# Altium schematic sheet SG_Power_Supplies.SchDoc
size A
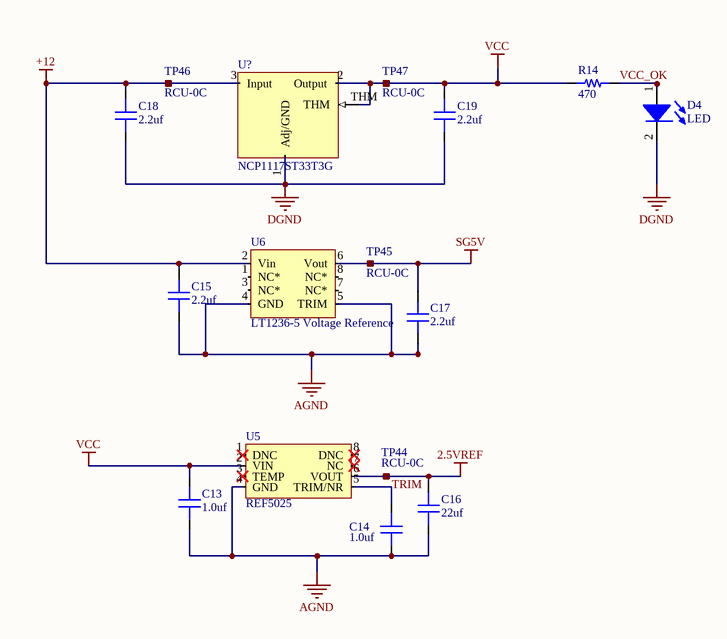
[diagram p0: SG_Power_Supplies.SchDoc]

## Parts
C13  value 1.0uf  [CAP 0603/1608]  (hidden comment: Capacitor MLCC 1.0uf 25V CAP 0603/1608)
C14  value 1.0uf  [CAP 0603/1608]  (hidden comment: Capacitor MLCC 1.0uf 25V CAP 0603/1608)
C15  value 2.2uf  [CAP 0603/1608]  (hidden comment: Capacitor MLCC 2.2uf 25V CAP 0603/1608)
C16  value 22uf  [CAP 0603/1608]  (hidden comment: Capacitor MLCC 22uf 16V CAP 0603/1608)
C17  value 2.2uf  [CAP 0603/1608]  (hidden comment: Capacitor MLCC 2.2uf 25V CAP 0603/1608)
C18  value 2.2uf  [CAP 0805/2012]  (hidden comment: Capacitor MLCC 2.2uf 25V CAP 0805/2012)
C19  value 2.2uf  [CAP 0805/2012]  (hidden comment: Capacitor MLCC 2.2uf 25V CAP 0805/2012)
D4  LED  [0805_LED]
R14  value 470  [RES 0805/2012]  (hidden comment: Resistor 470 0805 1/10W 1%)
TP44  RCU-0C  [RCU-0C]
TP45  RCU-0C  [RCU-0C]
TP46  RCU-0C  [RCU-0C]
TP47  RCU-0C  [RCU-0C]
U5  REF5025  [SOIC-8]
U6  LT1236-5 Voltage Reference  [SOIC-8]
U?  NCP1117ST33T3G  [SOT-223-3]

## Nets
2.5VREF: C16.2 TP44.1 U5.6(VOUT)
+12: C15.2 C18.2 TP46.1 U6.2(Vin) U?.3(Input)
AGND: C13.1 C14.1 C15.1 C16.1 C17.1 U5.4(GND) U6.4(GND) U6.5(TRIM)
DGND: C18.1 C19.1 D4.2(K) U?.1(Adj/GND)
SG5V: C17.2 TP45.1 U6.6(Vout)
VCC: C13.2 C19.2 R14.1 TP47.1 U5.2(VIN) U?.2(Output) U?.THM
TRIM: C14.2 U5.5(TRIM/NR)
VCC_OK: D4.1(A) R14.2

Not connected (* = marked no-connect by the designer): U5 1(DNC)* 3(TEMP)* 7(NC)* 8(DNC)*; U6 1(NC*) 3(NC*) 7(NC*) 8(NC*)

## Library data of the parts
C13 C14 = 589: Manufacturer_id: 1; idCapacitor: 589; Name: Cap_1.0uf_25V_CAP 0603/1608; Dielectric: Ceramic; Created_By: Nick Mah; Drawer_id: 1; Voltage_Rating: 25V; Package: CAP 0603/1608; Created_Date: 10/20/2018
C15 C17 = 591: Manufacturer_id: 1; idCapacitor: 591; Name: Cap_2.2uf_25V_CAP 0603/1608; Dielectric: Ceramic; Created_By: Nick Mah; Drawer_id: 1; Voltage_Rating: 25V; Package: CAP 0603/1608; Created_Date: 10/20/2018
C16 = 237: Manufacturer_id: 1; idCapacitor: 237; Name: Cap_22uf_16V_CAP 0603/1608; Dielectric: Ceramic; Created_By: Nick Mah; Drawer_id: 1; Voltage_Rating: 16V; Package: CAP 0603/1608; Created_Date: 10/20/2018
C18 C19 = 711: Manufacturer_id: 1; idCapacitor: 711; Name: Cap_2.2uf_25V_CAP 0805/2012; Dielectric: Ceramic; Created_By: Nick Mah; Drawer_id: 1; Voltage_Rating: 25V; Package: CAP 0805/2012; Created_Date: 10/20/2018
D4 = 2: Manufacturer_id: 1; idLED: 2; Name: CMD17_0805_GREEN; Value: Green; Brightness: 7mcd; Id: 20mA; Vf: 2.1V; Drawer_id: 1; Package: 0805; Link: https://www.digikey.com/product-detail/en/visual-communications-company-vcc/CMD17-21VGD-TR8/L62505CT-ND/254936
R14 = 497: Manufacturer_id: 1; idResistor: 497; Name: Res_470_0805_1/10W_1%; Created_By: Nick Mah; Supplier 1: Digi-Key; Drawer_id: 1; Tolerance: 1%; Power: 1/10W; Package: 0805; ComponentLink1Description: Datasheet; Created_Date: 2018-10-20
TP44-TP47 = 14: Test point; Manufacturer_id: 1; idConn: 14; Value: CONN; Created_By: Graydon; Updated_By: Null; Drawer_id: 1; Name: RCU-0C; Num_Contacts: 1; Num_Rows: 1; Package: RCU-0C; MfrPartNo: RCU-0C; Link: https://www.digikey.com/product-detail/en/te-connectivity-amp-connectors/RCU-0C/A106145CT-ND/3477802; ComponentLink1Description: Null; ComponentLink1URL: Null; Supplier1: None; Supplier1PartNo: None; Created_Date: 11/10/2018
U5 = 9: Series Voltage Reference IC ±0.1% 10mA 8-SOIC; Manufacturer_id: 1; MfrPartNo: REF5025AIDR; idPMIC_Lin: 9; Name: REF5025_2.5V_Reg; Value: 2.5V Reference; Vin(Min): 2.7V; Vin(Max): 18V; Vout(Min): 2.5V; Vout_Type: Fixed; Dropout_Voltage: 200mV; Drawer_id: 1; Num_Outputs: 1; Power: Reference; Vout(Max): 2.5V; Current_Rating: 10mA; Package: SOIC-8; Link: https://www.digikey.com/product-detail/en/texas-instruments/REF5025AIDR/296-39165-2-ND/1900163; ComponentLink1Description: Datasheet; ComponentLink1URL: http://www.ti.com/lit/ds/symlink/ref5020.pdf; Supplier1: Digi-Key; Supplier1PartNo: 296-39165-2-ND
U6 = 2: Manufacturer_id: 1; idIC_Misc: 2; Name: Voltage Ref LT1236-5; Drawer_id: 1
U? = 15: 1.0 A Low Dropout Positive and Adjustable Voltage Regulator; Manufacturer_id: 1; idPMIC_Lin: 15; Name: 3.3V 1.0A LDO; Value: 3.3V 1.0A; Vin(Max): 20V; Vout(Max): 3.3V; Current_Rating: 1A; Dropout_Voltage: 1.2V @ 800mA; Drawer_id: 1; Num_Outputs: 1; Package: SOT-223-3; MfrPartNo: NCP1117ST33T3G; Link: https://www.digikey.com/product-detail/en/on-semiconductor/NCP1117ST33T3G/NCP1117ST33T3GOSCT-ND/660708?utm_adgroup=Integrated%20Circuits&slid=&gclid=CjwKCAjwpKveBRAwEiwAo4Pqm-q33kFM8zFNc6HZ2F-pR13_ETd6YlqjCAqcJjAXoyQWdArbQQWp4hoCk3EQAvD_BwE